# Altium schematic sheet relay_noprotection.SchDoc
size A
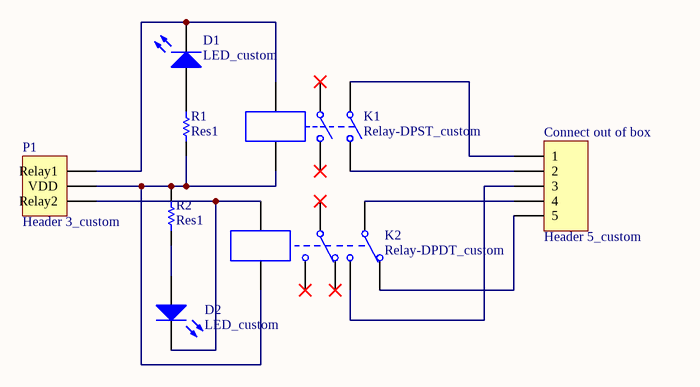
[diagram p0: relay_noprotection.SchDoc]

## Parts
Connect_out_of_box  Header 5_custom  [TE5]
D1  LED_custom  [LED_Custom]
D2  LED_custom  [LED_Custom]
K1  Relay-DPST_custom  [Relay-DPST_custom]
K2  Relay-DPDT_custom  [Relay-DPDT_custom]
P1  Header 3_custom  [TB3]
R1  Res1  [AXIAL-0.3]
R2  Res1  [AXIAL-0.3]

## Nets
NetConnect_out_of_box_1: Connect_out_of_box.1 K1.1
NetConnect_out_of_box_2: Connect_out_of_box.2 K1.2
NetConnect_out_of_box_3: Connect_out_of_box.3 K2.3
NetConnect_out_of_box_4: Connect_out_of_box.4 K2.1
NetConnect_out_of_box_5: Connect_out_of_box.5 K2.2
NetD1_1: D1.1(A) R1.2
NetD1_2: D1.2(K) K1.5 P1.3(Relay1)
NetD2_1: D2.1(A) R2.2
NetD2_2: D2.2(K) K2.7 P1.1(Relay2)
NetK1_6: K1.6 K2.8 P1.2(VDD) R1.1 R2.1

Not connected (* = marked no-connect by the designer): K1 3* 4*; K2 4* 5* 6*

## Library data of the parts
Connect_out_of_box = Header 5_custom: Header, 5-Pin; LatestRevisionDate: 17-Jul-2002; LatestRevisionNote: Re-released for DXP Platform.; Publisher: Altium Limited
D1 D2 = LED_custom: Typical INFRARED GaAs LED; Published: 8-Jun-2000; LatestRevisionDate: 08-Jul-2005; LatestRevisionNote: Mech Layer 1 removed.; PackageReference: LED-0; Publisher: Altium Limited; PackageDescription: LED; 2 Leads
K1 = Relay-DPST_custom: Dual-Pole Single-Throw Relay; Published: 24-Mar-1999; LatestRevisionDate: 17-Jul-2002; LatestRevisionNote: Re-released for DXP Platform.; PackageReference: MODULE6; Publisher: Altium Limited
K2 = Relay-DPDT_custom: Dual-Pole Dual-Throw Relay; Published: 24-Mar-1999; LatestRevisionDate: 17-Jul-2002; LatestRevisionNote: Re-released for DXP Platform.; PackageReference: DIP-P8; Publisher: Altium Limited; PackageDescription: Relay; 8 Leads
P1 = Header 3_custom: Header, 3-Pin; LatestRevisionDate: 17-Jul-2002; LatestRevisionNote: Re-released for DXP Platform.; Publisher: Altium Limited
R1 R2 = Res1: Resistor; Published: 8-Jun-2000; LatestRevisionDate: 17-Jul-2002; LatestRevisionNote: Re-released for DXP Platform.; PackageReference: AXIAL-0.3; Publisher: Altium Limited; PackageDescription: Axial Device, Thru-Hole; 2 Leads; 0.3 in Pin Spacing